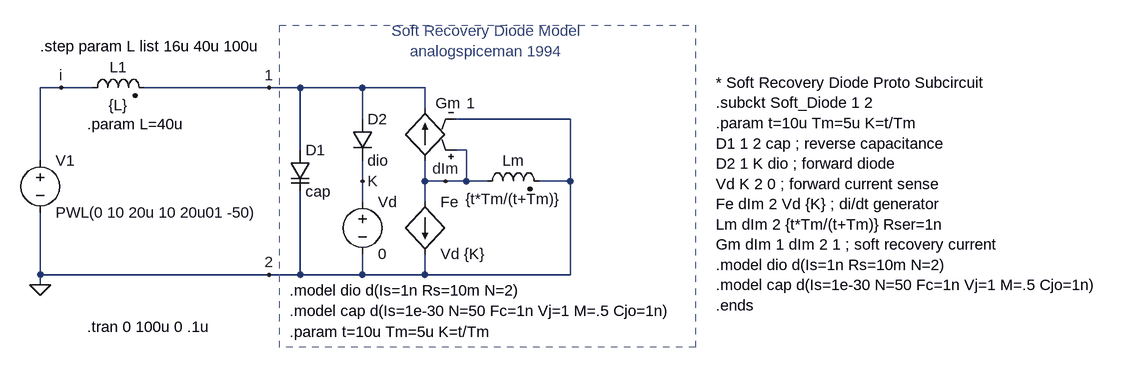
[diagram p0: schematic Soft_Diode.asc]
Soft_Diode.asc, the LTspice schematic file:
Version 4
SHEET 1 1704 728
WIRE -128 224 -128 112
WIRE -128 400 -128 304
WIRE -128 416 -128 400
WIRE -96 112 -128 112
WIRE -48 112 -96 112
WIRE 224 112 32 112
WIRE 224 400 -128 400
WIRE 272 112 224 112
WIRE 272 208 272 112
WIRE 272 400 224 400
WIRE 272 400 272 272
WIRE 368 112 272 112
WIRE 368 160 368 112
WIRE 368 256 368 224
WIRE 368 288 368 256
WIRE 368 400 272 400
WIRE 368 400 368 368
WIRE 464 112 368 112
WIRE 464 144 464 112
WIRE 464 256 464 224
WIRE 464 288 464 256
WIRE 464 400 368 400
WIRE 464 400 464 368
WIRE 496 256 464 256
WIRE 528 208 512 208
WIRE 528 256 496 256
WIRE 528 256 528 208
WIRE 560 256 528 256
WIRE 688 160 512 160
WIRE 688 256 640 256
WIRE 688 256 688 160
WIRE 688 400 464 400
WIRE 688 400 688 256
FLAG -128 416 0
FLAG 496 256 dIm
FLAG 368 256 K
FLAG 224 112 1
FLAG 224 400 2
FLAG -96 112 i
SYMBOL voltage -128 208 R0
WINDOW 123 0 0 Left 0
WINDOW 39 0 0 Left 0
SYMATTR InstName V1
SYMATTR Value PWL(0 10 20u 10 20u01 -50)
SYMBOL ind2 -64 128 R270
WINDOW 0 32 56 VTop 0
WINDOW 3 5 56 VBottom 0
SYMATTR InstName L1
SYMATTR Value {L}
SYMATTR Type ind
SYMATTR SpiceLine Rser=1 Rpar=500 Cpar=10p
SYMBOL diode 352 160 R0
SYMATTR InstName D2
SYMATTR Value dio
SYMBOL voltage 368 272 R0
SYMATTR InstName Vd
SYMATTR Value 0
SYMBOL ind2 544 272 R270
WINDOW 0 32 56 VTop 0
WINDOW 3 4 56 VBottom 0
SYMATTR InstName Lm
SYMATTR Value {t*Tm/(t+Tm)}
SYMATTR Type ind
SYMATTR SpiceLine Rser=1n
SYMBOL varactor 256 208 R0
SYMATTR InstName D1
SYMATTR Value cap
SYMBOL f 464 288 R0
SYMATTR InstName Fe
SYMATTR Value Vd {K}
SYMBOL g2 464 128 M0
WINDOW 0 -16 8 Right 0
WINDOW 3 -64 8 Right 0
SYMATTR InstName Gm
SYMATTR Value 1
TEXT 560 40 Center 0 ;Soft Recovery Diode Model\nanalogspiceman 1994
TEXT 256 424 Left 0 !.model dio d(Is=1n Rs=10m N=2)
TEXT 256 488 Left 0 !.param t=10u Tm=5u K=t/Tm
TEXT -56 480 Left 0 !.tran 0 100u 0 .1u
TEXT 256 456 Left 0 !.model cap d(Is=1e-30 N=50 Fc=1n Vj=1 M=.5 Cjo=1n)
TEXT -128 48 Left 0 !.step param L list 16u 40u 100u
TEXT -56 168 Left 0 !.param L=40u
TEXT 912 104 Left 0 !* Soft Recovery Diode Proto Subcircuit\n.subckt Soft_Diode 1 2\n.param t=10u Tm=5u K=t/Tm\nD1 1 2 cap ; reverse capacitance\nD2 1 K dio ; forward diode\nVd K 2 0 ; forward current sense\nFe dIm 2 Vd {K} ; di/dt generator\nLm dIm 2 {t*Tm/(t+Tm)} Rser=1n\nGm dIm 1 dIm 2 1 ; soft recovery current \n.model dio d(Is=1n Rs=10m N=2)\n.model cap d(Is=1e-30 N=50 Fc=1n Vj=1 M=.5 Cjo=1n)\n.ends
RECTANGLE Normal 880 512 240 16 2

The netlist it stands for:
* Soft_Diode.asc
V1 i 0 PWL(0 10 20u 10 20u01 -50)
L1 i 1 {L} Rser=1 Rpar=500 Cpar=10p
D2 1 K dio
Vd K 0 0
Lm dIm 0 {t*Tm/(t+Tm)} Rser=1n
D1 1 0 cap
Fe dIm 0 Vd {K}
Gm dIm 1 dIm 0 1
.model D D
.lib standard.dio
* Soft Recovery Diode Model
* analogspiceman 1994
.model dio d(Is=1n Rs=10m N=2)
.param t=10u Tm=5u K=t/Tm
.tran 0 100u 0 .1u
.model cap d(Is=1e-30 N=50 Fc=1n Vj=1 M=.5 Cjo=1n)
.step param L list 16u 40u 100u
.param L=40u
* Soft Recovery Diode Proto Subcircuit
.subckt Soft_Diode 1 2
.param t=10u Tm=5u K=t/Tm
D1 1 2 cap ; reverse capacitance
D2 1 K dio ; forward diode
Vd K 2 0 ; forward current sense
Fe dIm 2 Vd {K} ; di/dt generator
Lm dIm 2 {t*Tm/(t+Tm)} Rser=1n
Gm dIm 1 dIm 2 1 ; soft recovery current
.model dio d(Is=1n Rs=10m N=2)
.model cap d(Is=1e-30 N=50 Fc=1n Vj=1 M=.5 Cjo=1n)
.ends
.backanno
.end